# Altium schematic sheet NAND Flash - QSPI.SchDoc
size A3; Author: ALP Electronics; CompanyName: ALP Electronics; DrawnBy: Caner Alp; Engineer: Caner Alp; Organization: ALP Electronics; Address2: Västerås; Address4: Sweden; SheetNumber: 6; SheetTotal: 14
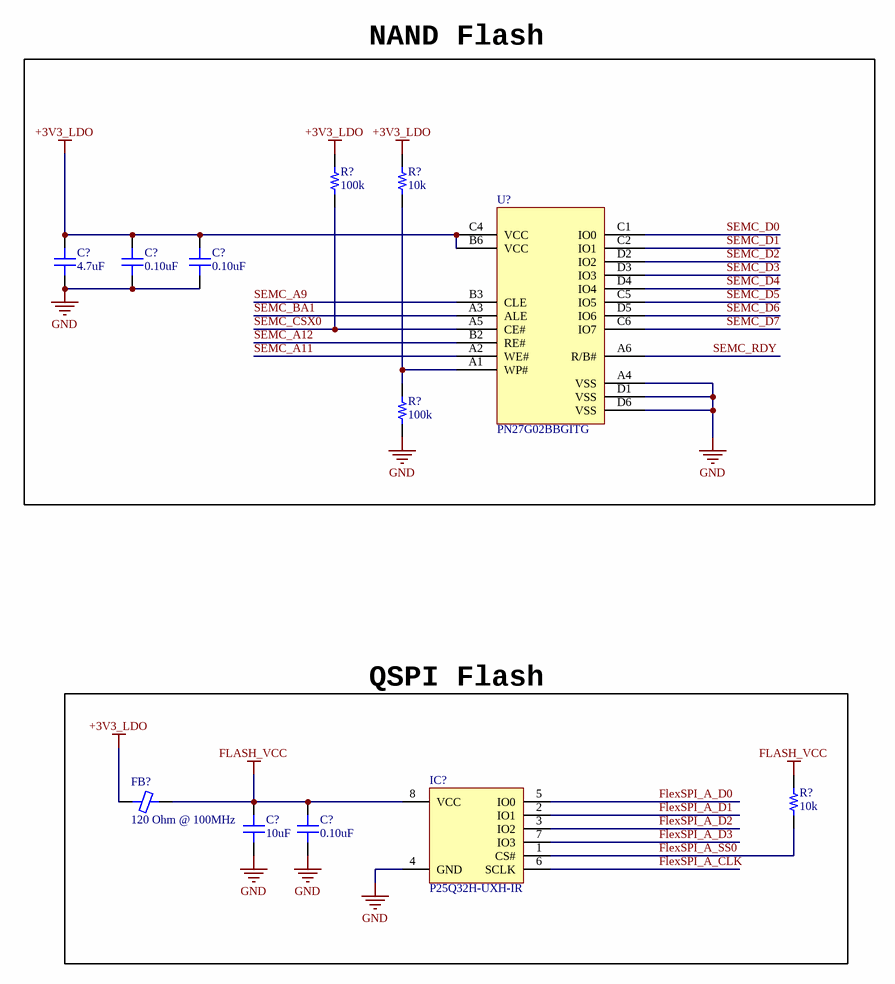
[diagram p0: NAND Flash - QSPI.SchDoc]

## Parts
(Parts that share a designator on the sheet are numbered #1, #2 ... from top to bottom, then left to right.)
C?#1  4.7uF  [CAP 0402/1005]
C?#2  0.10uF  [CAP 0402/1005]
C?#3  0.10uF  [CAP 0402/1005]
C?#4  10uF  [CAP 0402/1005]
C?#5  0.10uF  [CAP 0402/1005]
FB?  120 Ohm @ 100MHz  [FER 0402/1005]
IC?  P25Q32H-UXH-IR  [SON50P300X200X60-9N]
R?#1  100k  [RES 0402/1005]
R?#2  10k  [RES 0402/1005]
R?#3  100k  [RES 0402/1005]
R?#4  10k  [RES 0402/1005]
U?  PN27G02BBGITG  [BGA24 8x6]

## Blocks framed on the sheet
NAND Flash: C?#1-C?#3 R?#1-R?#3 U?
QSPI Flash: C?#4 C?#5 FB? IC? R?#4

## Nets
+3V3_LDO: C?#1.2 C?#2.2 C?#3.2 FB?.1 R?#1.1 R?#2.2 U?.B6(VCC) U?.C4(VCC)
FLASH_VCC: C?#4.2 C?#5.2 FB?.2 IC?.8(VCC) R?#4.2
GND: C?#1.1 C?#2.1 C?#3.1 C?#4.1 C?#5.1 IC?.4(GND) R?#3.2 U?.A4(VSS) U?.D1(VSS) U?.D6(VSS)
FlexSPI_A_CLK: IC?.6(SCLK)
FlexSPI_A_D0: IC?.5(IO0)
FlexSPI_A_D1: IC?.2(IO1)
FlexSPI_A_D2: IC?.3(IO2)
FlexSPI_A_D3: IC?.7(IO3)
FlexSPI_A_SS0: IC?.1(CS#) R?#4.1
SEMC_A9: U?.B3(CLE)
SEMC_A11: U?.A2(WE#)
SEMC_A12: U?.B2(RE#)
SEMC_BA1: U?.A3(ALE)
SEMC_CSX0: R?#1.2 U?.A5(CE#)
SEMC_D0: U?.C1(IO0)
SEMC_D1: U?.C2(IO1)
SEMC_D2: U?.D2(IO2)
SEMC_D3: U?.D3(IO3)
SEMC_D4: U?.D4(IO4)
SEMC_D5: U?.C5(IO5)
SEMC_D6: U?.D5(IO6)
SEMC_D7: U?.C6(IO7)
SEMC_RDY: U?.A6(R/B#)
NetR?#2_1: R?#2.1 R?#3.1 U?.A1(WP#)

Not connected (* = marked no-connect by the designer): U? B1(NC) B4(NC) B5(NC) C3(NC)

## Notes on the sheet
- Title:
- Size:
- Project:
- A3
- Date:
- Revision:
- Drawn By:
- Sheet
- of

## Library data of the parts
C?#1 = C0402C475M9PAC7867: CAP CER 4.7UF 6.3V X5R 0402; Manufacturer: Kemet; TemperatureRange: -55C ~ 85C; Tolerance: 20%; Value: 4.7uF; Part Number: C0402C475M9PAC7867; PartId: 12865; Supplier 1: Digi-Key; Supplier Part Number 1: 399-13068-2-ND; ComponentLink1Description: Datasheet; ComponentLink1URL: http://www.kemet.com/docfinder?Partnumber=C0402C475M9PAC7867; ComponentLink2Description: Digi-Key Listing; ComponentLink2URL: https://www.digikey.com/product-detail/en/kemet/C0402C475M9PAC7867/399-13068-2-ND/5767551; TemperatureCoefficient: X5R; Voltage: 6.3V; Price: 0,063; Device Package: 0402 (1005 Metric)
C?#2 C?#3 C?#5 = LMK105BJ104KV-F: CAP CER 0.1UF 10V X5R 0402; Manufacturer: Taiyo Yuden; TemperatureRange: -55C ~ 85C; Tolerance: 10%; Value: 0.10uF; Part Number: LMK105BJ104KV-F; PartId: 12322; Supplier 1: Digi-Key; Supplier Part Number 1: 587-1227-2-ND; ComponentLink1Description: Datasheet; ComponentLink1URL: http://ds.yuden.co.jp/TYCOMPAS/ut/detail.do?productNo=LMK105BJ104KV-F&fileName=LMK105BJ104KV-F_SS&mode=specSheetDownload; ComponentLink2Description: Digi-Key Listing; ComponentLink2URL: https://www.digikey.com/product-detail/en/taiyo-yuden/LMK105BJ104KV-F/587-1227-2-ND/930579; TemperatureCoefficient: X5R; Voltage: 10V; Price: 0,0021; Device Package: 0402 (1005 Metric)
C?#4 = C1005X5R0J106M050BC: CAP CER 10UF 6.3V X5R 0402; Manufacturer: TDK Corporation; TemperatureRange: -55C ~ 85C; Tolerance: 20%; Value: 10uF; Part Number: C1005X5R0J106M050BC; PartId: 12380; Supplier 1: Digi-Key; Supplier Part Number 1: 445-8920-2-ND; ComponentLink1Description: Datasheet; ComponentLink1URL: https://product.tdk.com/info/en/catalog/datasheets/mlcc_commercial_general_en.pdf; ComponentLink2Description: Digi-Key Listing; ComponentLink2URL: https://www.digikey.com/product-detail/en/tdk-corporation/C1005X5R0J106M050BC/445-8920-2-ND/3507809; TemperatureCoefficient: X5R; Voltage: 6.3V; Price: 0,119; Device Package: 0402 (1005 Metric)
FB? = CIM05U121NC: FERRITE CHIP 120 OHM 600MA 0402; Manufacturer: Samsung Electro-Mechanics America, Inc.; Type: Differential Mode - Single; DC Resistance: 250 mOhm Max; Part Number: CIM05U121NC; PartId: 6447; Value: 120 Ohm @ 100MHz; Supplier 1: Digi-Key; Supplier Part Number 1: 1276-6345-2-ND; ComponentLink1Description: Datasheet; ComponentLink1URL: http://www.samsungsem.com/kr/front/downloadcms.do?path=/kr/support/product-search/bead/__icsFiles/afieldfile/2014/11/13&fileName=S_CIM05J102NC.pdf; ComponentLink2Description: Digi-Key listing; ComponentLink2URL: http://digikey.com/product-detail/en/CIM05U121NC/1276-6345-2-ND/3973775; Price: 0,0147; Device Package: 0402 (1005 Metric); Current Rating: 600mA
IC? = P25Q32H: Integrated Circuit; Manufacturer_Name: Puya Semiconductor; Datasheet Link: https://datasheet.lcsc.com/lcsc/1912111437_-PUYA--P25Q32H-UXH-IR_C414068.pdf; Height: 0.55; Manufacturer_Part_Number: P25Q32H
R?#1 R?#3 = ERJ-2GEJ104X: RES SMD 100K OHM 5% 1/10W 0402; Manufacturer: Panasonic Electronic Components; TemperatureRange: -55C ~ 155C; TemperatureCoefficient: 200ppm/C; PowerRating: 0.1W, 1/10W; Value: 100k; Part Number: ERJ-2GEJ104X; PartId: 10985; Supplier 1: Digi-Key; Supplier Part Number 1: P100KJTR-ND; ComponentLink1Description: Datasheet; ComponentLink1URL: http://industrial.panasonic.com/www-cgi/jvcr13pz.cgi?E+PZ+3+AOA0001+ERJ2GEJ104X+7+WW; ComponentLink2Description: Digi-Key Listing; ComponentLink2URL: https://www.digikey.com/product-detail/en/panasonic-electronic-components/ERJ-2GEJ104X/P100KJTR-ND/146731; Tolerance: 5%; Price: 0,0019; Device Package: 0402 (1005 Metric)
R?#2 R?#4 = RC0402JR-0710KL: RES SMD 10K OHM 5% 1/16W 0402; Manufacturer: Yageo; TemperatureRange: -55C ~ 155C; TemperatureCoefficient: 100ppm/C; PowerRating: 0.063W, 1/16W; Value: 10k; Part Number: RC0402JR-0710KL; PartId: 14464; Supplier 1: Digi-Key; Supplier Part Number 1: 311-10KJRTR-ND; ComponentLink1Description: Datasheet; ComponentLink1URL: http://www.yageo.com/documents/recent/PYu-RC_Group_51_RoHS_L_04.pdf; ComponentLink2Description: Digi-Key Listing; ComponentLink2URL: https://www.digikey.com/product-detail/en/yageo/RC0402JR-0710KL/311-10KJRTR-ND/726418; Tolerance: 5%; Price: 0,0017; Device Package: 0402 (1005 Metric)
U? = PN27G02BBGITG: NAND